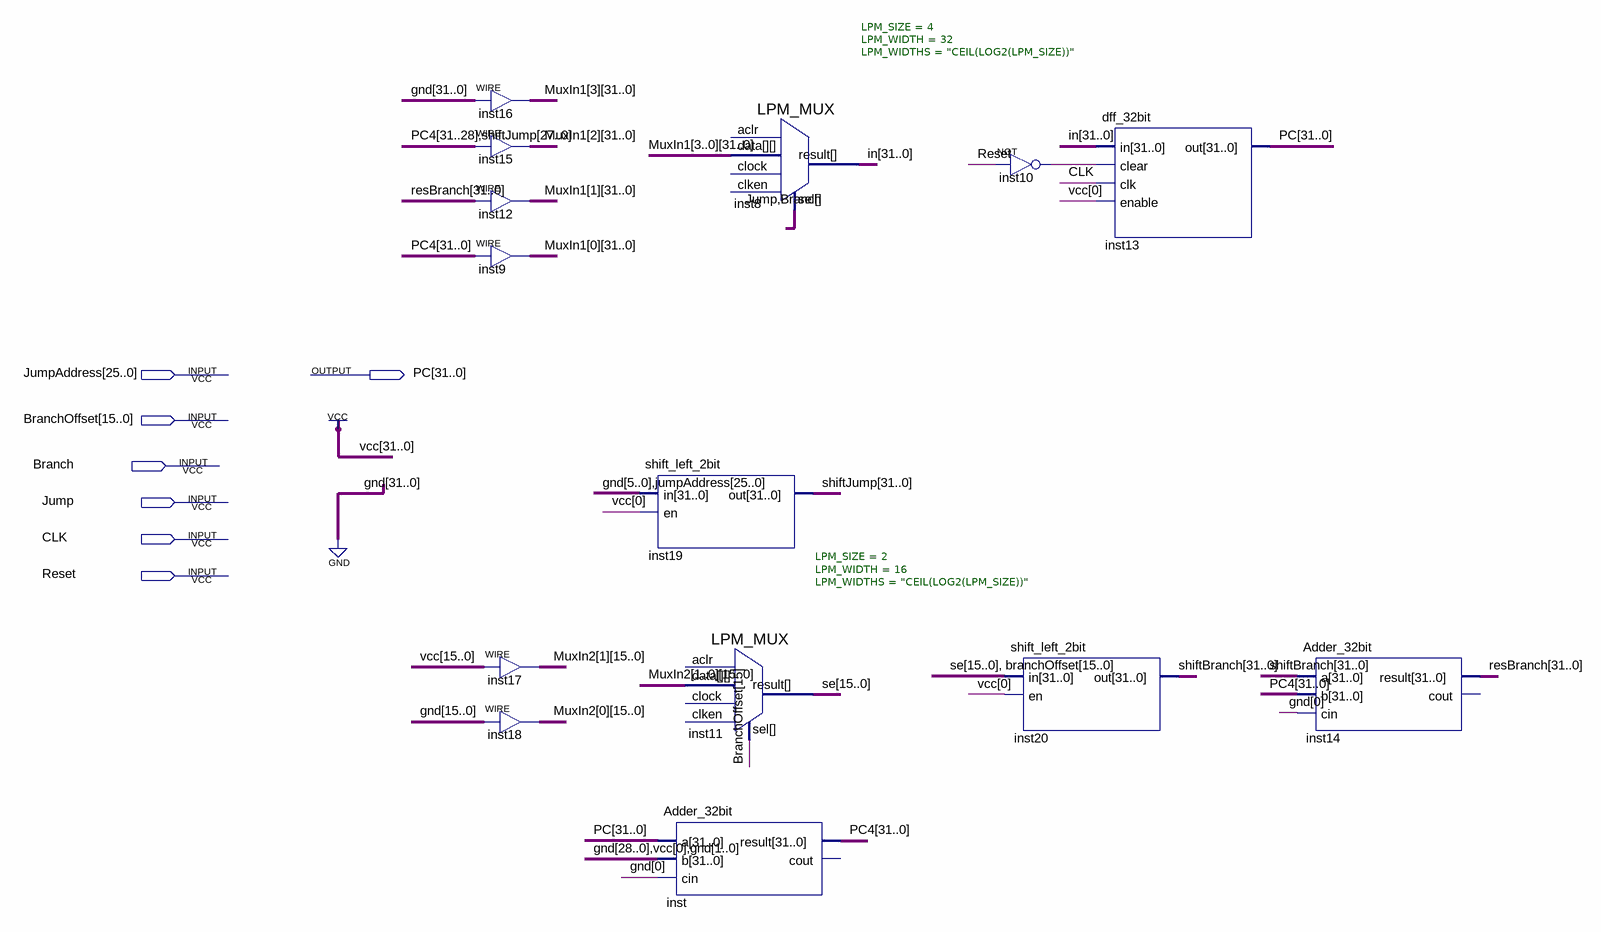
[diagram p0: schematic sheet]
// Quartus schematic PC.bdf as structural Verilog: 14 symbols, 7 pins
module PC (
  input  [25:0] JumpAddress,
  input  [15:0] BranchOffset,
  input  Branch,
  input  Jump,
  input  CLK,
  input  Reset,
  output [31:0] PC
);

  wire inst10_out;
  wire [15:0] MuxIn2_0, MuxIn2_1, se;
  wire [31:0] in, MuxIn1_0, MuxIn1_1, MuxIn1_2, MuxIn1_3, PC4, resBranch, shiftBranch, shiftJump;

  assign MuxIn1_3 = {32{1'b0}};  // WIRE inst16
  assign MuxIn1_2 = {PC4[31:28], shiftJump[27:0]};  // WIRE inst15
  assign MuxIn1_1 = resBranch;  // WIRE inst12
  assign MuxIn1_0 = PC4;  // WIRE inst9
  assign MuxIn2_1 = {16{1'b1}};  // WIRE inst17
  assign MuxIn2_0 = {16{1'b0}};  // WIRE inst18
  shift_left_2bit inst19 (.in({{6{1'b0}}, JumpAddress}), .en(1'b1), .out(shiftJump));
  Adder_32bit inst (.a(PC), .b(32'b00000000000000000000000000000100), .cin(1'b0), .result(PC4));  // open: cout
  LPM_MUX #(.LPM_SIZE(4), .LPM_WIDTH(32), .LPM_WIDTHS("CEIL(LOG2(LPM_SIZE))")) inst8 (
    .data({MuxIn1_3, MuxIn1_2, MuxIn1_1, MuxIn1_0}), .sel({Jump, Branch}), .result(in));  // open: clock, aclr, clken
  LPM_MUX #(.LPM_SIZE(2), .LPM_WIDTH(16), .LPM_WIDTHS("CEIL(LOG2(LPM_SIZE))")) inst11 (
    .data({MuxIn2_1, MuxIn2_0}), .sel(BranchOffset[15]), .result(se));  // open: clock, aclr, clken
  not inst10 (inst10_out, Reset);
  shift_left_2bit inst20 (.in({se, BranchOffset}), .en(1'b1), .out(shiftBranch));
  dff_32bit inst13 (.in(in), .clear(inst10_out), .clk(CLK), .enable(1'b1), .out(PC));
  Adder_32bit inst14 (.a(shiftBranch), .b(PC4), .cin(1'b0), .result(resBranch));  // open: cout
endmodule
